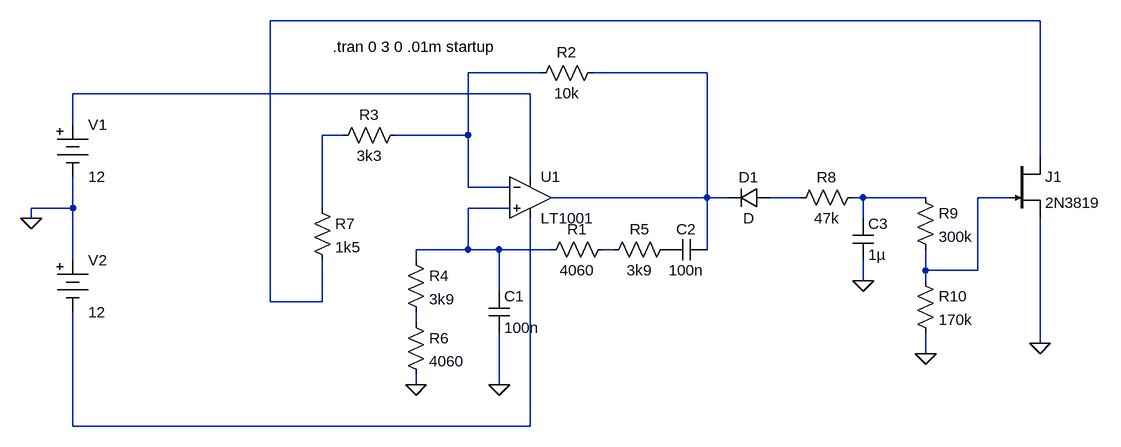
[diagram p0: schematic wien6.asc]
wien6.asc, the LTspice schematic file:
Version 4
SHEET 1 1068 680
WIRE 928 -128 -256 -128
WIRE 160 -48 48 -48
WIRE 416 -48 240 -48
WIRE 144 -16 -560 -16
WIRE -560 32 -560 -16
WIRE -144 48 -176 48
WIRE 48 48 48 -48
WIRE 48 48 -64 48
WIRE 928 80 928 -128
WIRE 144 112 144 -16
WIRE 48 128 48 48
WIRE 112 128 48 128
WIRE 416 144 416 -48
WIRE 416 144 176 144
WIRE 448 144 416 144
WIRE 560 144 512 144
WIRE 656 144 640 144
WIRE 752 144 656 144
WIRE 880 144 832 144
WIRE -560 160 -560 112
WIRE -560 160 -624 160
WIRE -176 160 -176 48
WIRE 112 160 48 160
WIRE -624 176 -624 160
WIRE 656 176 656 144
WIRE 48 224 48 160
WIRE 48 224 -32 224
WIRE 96 224 48 224
WIRE 176 224 96 224
WIRE 272 224 256 224
WIRE 416 224 416 144
WIRE -560 240 -560 160
WIRE -32 240 -32 224
WIRE 752 256 752 224
WIRE 832 256 832 144
WIRE 832 256 752 256
WIRE 656 272 656 240
WIRE 752 272 752 256
WIRE 96 288 96 224
WIRE -256 304 -256 -128
WIRE -176 304 -176 240
WIRE -176 304 -256 304
WIRE -32 336 -32 320
WIRE 928 368 928 176
WIRE 752 384 752 352
WIRE -32 432 -32 416
WIRE 96 432 96 352
WIRE -560 496 -560 320
WIRE 144 496 144 176
WIRE 144 496 -560 496
FLAG -32 432 0
FLAG -624 176 0
FLAG 96 432 0
FLAG 656 272 0
FLAG 752 384 0
FLAG 928 368 0
SYMBOL Opamps\\LT1001 144 80 R0
SYMATTR InstName U1
SYMBOL res 256 -64 R90
WINDOW 0 0 56 VBottom 2
WINDOW 3 32 56 VTop 2
SYMATTR InstName R2
SYMATTR Value 10k
SYMBOL res -48 32 R90
WINDOW 0 0 56 VBottom 2
WINDOW 3 32 56 VTop 2
SYMATTR InstName R3
SYMATTR Value 3k3
SYMBOL cap 80 288 R0
SYMATTR InstName C1
SYMATTR Value 100n
SYMBOL res 368 208 R90
WINDOW 0 0 56 VBottom 2
WINDOW 3 32 56 VTop 2
SYMATTR InstName R5
SYMATTR Value 3k9
SYMBOL cap 416 208 R90
WINDOW 0 0 32 VBottom 2
WINDOW 3 32 32 VTop 2
SYMATTR InstName C2
SYMATTR Value 100n
SYMBOL res -48 224 R0
SYMATTR InstName R4
SYMATTR Value 3k9
SYMBOL Misc\\battery -560 16 R0
WINDOW 123 0 0 Left 2
WINDOW 39 0 0 Left 2
SYMATTR InstName V1
SYMATTR Value 12
SYMBOL Misc\\battery -560 224 R0
WINDOW 123 0 0 Left 2
WINDOW 39 0 0 Left 2
SYMATTR InstName V2
SYMATTR Value 12
SYMBOL res 272 208 R90
WINDOW 0 0 56 VBottom 2
WINDOW 3 32 56 VTop 2
SYMATTR InstName R1
SYMATTR Value 4060
SYMBOL res -48 320 R0
SYMATTR InstName R6
SYMATTR Value 4060
SYMBOL res -192 144 R0
SYMATTR InstName R7
SYMATTR Value 1k5
SYMBOL diode 512 128 R90
WINDOW 0 0 32 VBottom 2
WINDOW 3 32 32 VTop 2
SYMATTR InstName D1
SYMBOL res 656 128 R90
WINDOW 0 0 56 VBottom 2
WINDOW 3 32 56 VTop 2
SYMATTR InstName R8
SYMATTR Value 47k
SYMBOL cap 640 176 R0
SYMATTR InstName C3
SYMATTR Value 1µ
SYMBOL res 736 128 R0
SYMATTR InstName R9
SYMATTR Value 300k
SYMBOL res 736 256 R0
SYMATTR InstName R10
SYMATTR Value 170k
SYMBOL njf 880 80 R0
SYMATTR InstName J1
SYMATTR Value 2N3819
TEXT -160 -88 Left 2 !.tran 0 3 0 .01m startup

The netlist it stands for:
* wien6.asc
XU1 N009 N002 N004 N012 N003 LT1001  ; pins In+ In- V+ V- OUT
R2 N003 N002 10k
R3 N002 N005 3k3
C1 N009 0 100n
R5 P001 N010 3k9
C2 N003 P001 100n
R4 N009 N011 3k9
V1 N004 0 12
V2 0 N012 12
R1 N010 N009 4060
R6 N011 0 4060
R7 N005 N001 1k5
D1 N006 N003 D
R8 N007 N006 47k
C3 N007 0 1µ
R9 N007 N008 300k
R10 N008 0 170k
J1 N001 N008 0 2N3819
.model D D
.lib standard.dio
.model NJF NJF
.model PJF PJF
.lib standard.jft
.tran 0 3 0 .01m startup
.lib LTC.lib
.backanno
.end